# EAGLE design DDS2-03 (EAGLE 4.16)
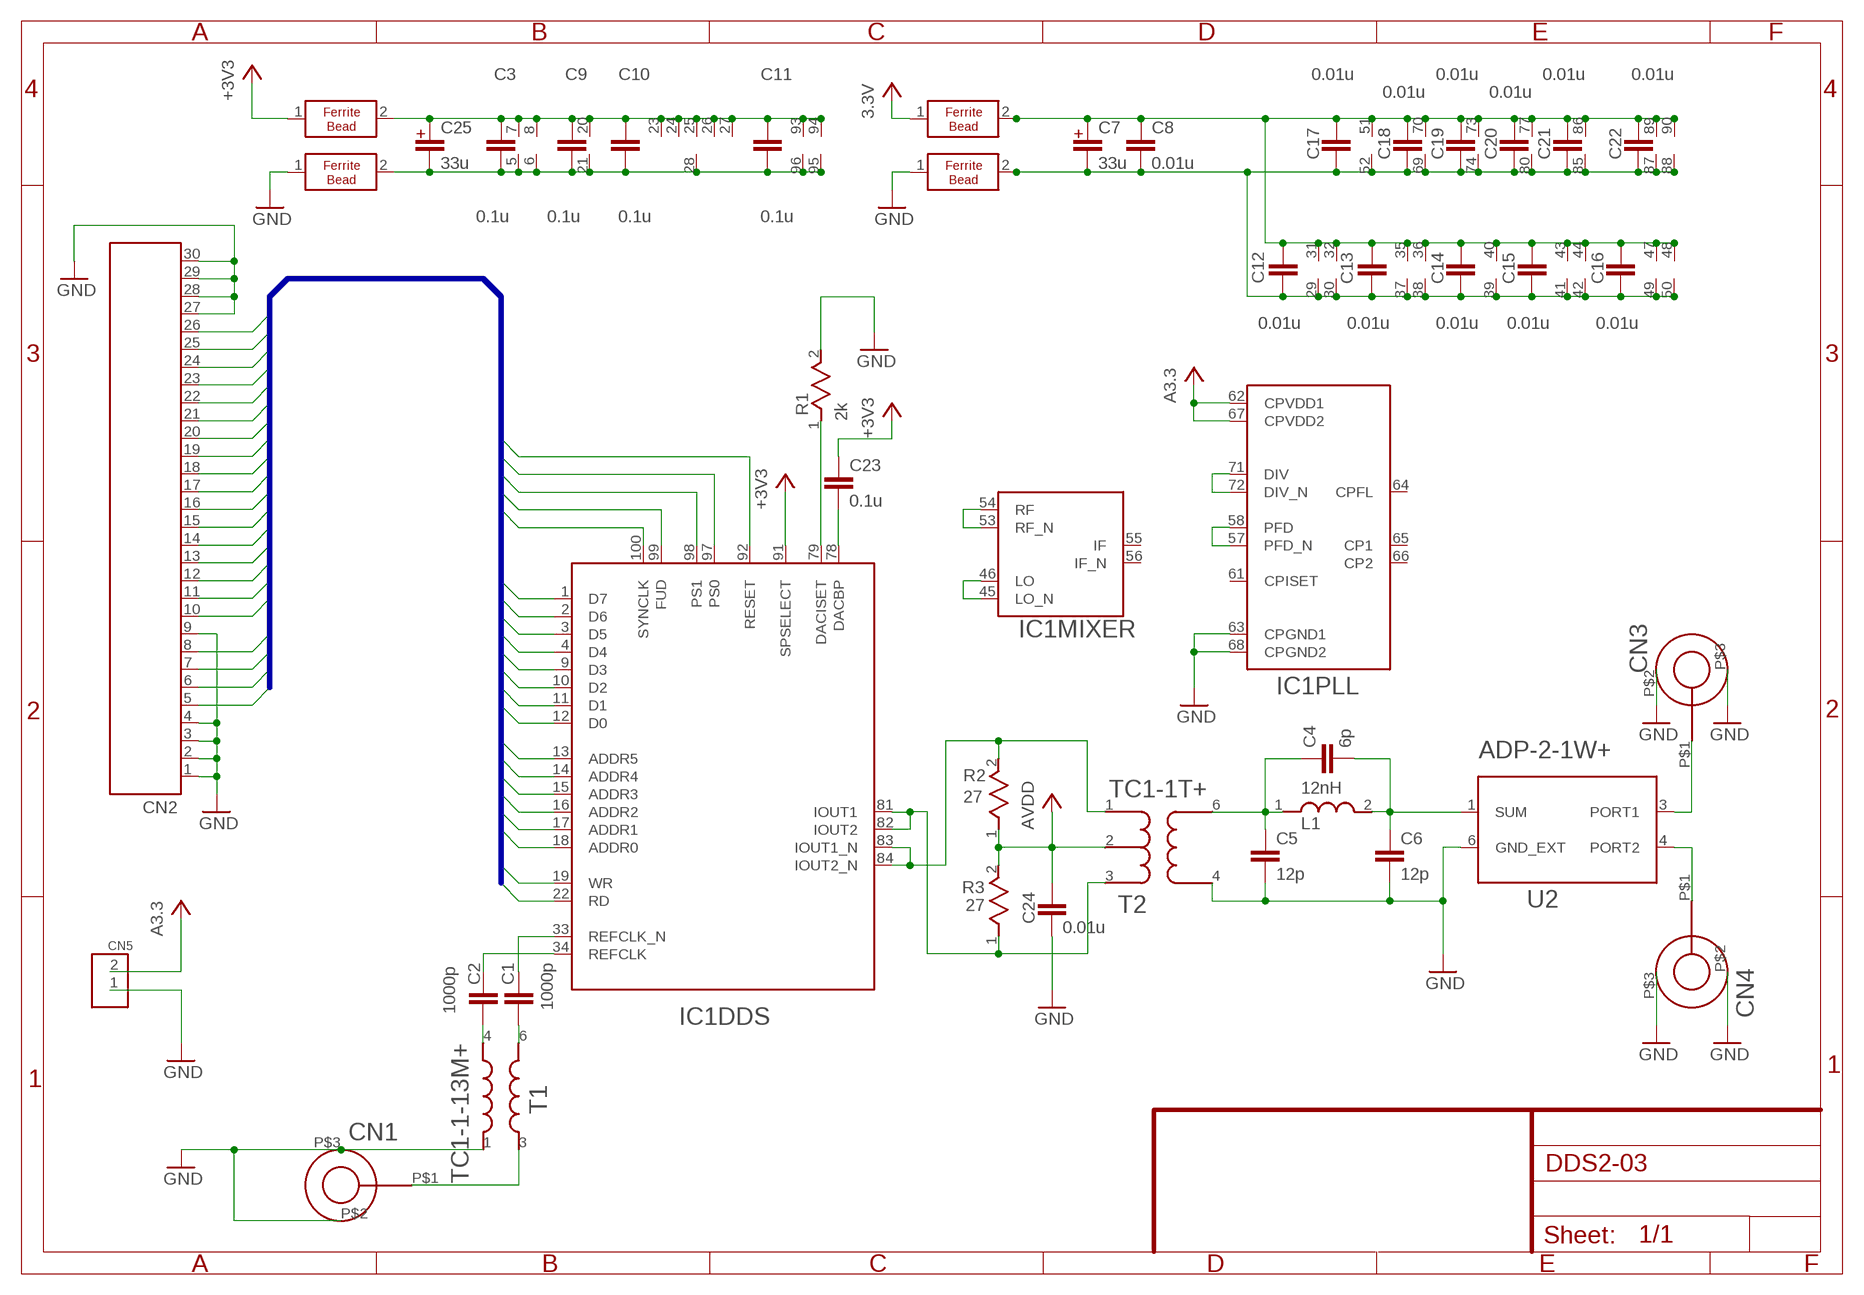
[diagram p0: schematic, sheet 1]

## Parts
C1  1000p  C1005  [1005]
C2  1000p  C1005  [1005]
C3  0.1u  C1005  [1005]
C4  6p  C1608  [1608]
C5  12p  C1608  [1608]
C6  12p  C1608  [1608]
C7  33u  C_POLAR3216  [3216_POLAR]
C8  0.01u  C1608  [1608]
C9  0.1u  C1005  [1005]
C10  0.1u  C1005  [1005]
C11  0.1u  C1005  [1005]
C12  0.01u  C1005  [1005]
C13  0.01u  C1005  [1005]
C14  0.01u  C1005  [1005]
C15  0.01u  C1005  [1005]
C16  0.01u  C1005  [1005]
C17  0.01u  C1005  [1005]
C18  0.01u  C1005  [1005]
C19  0.01u  C1005  [1005]
C20  0.01u  C1005  [1005]
C21  0.01u  C1005  [1005]
C22  0.01u  C1005  [1005]
C23  0.1u  C1005  [1005]
C24  0.01u  C1005  [1005]
C25  33u  C_POLAR3216  [3216_POLAR]
CN1  U.FL-R-SMT  [U.FL-R-SMT]
CN2  FH12-30S-0.5SH  [FPC_30]
CN3  U.FL-R-SMT  [U.FL-R-SMT]
CN4  U.FL-R-SMT  [U.FL-R-SMT]
CN5  DF13-2P-1.25V  [DF13-2P-12.5V]
FB1  FERRITEBEAD  [1608]
FB2  FERRITEBEAD  [1608]
FB3  FERRITEBEAD  [1608]
FB4  FERRITEBEAD  [1608]
IC1  AD9858SV-100  [AD9858]
L1  12nH  L  [1608]
R1  2k  R1005  [1005]
R2  27  R1005  [1005]
R3  27  R1005  [1005]
T1  TC1-1-13M+  [AT224]
T2  TC1-1T+  [AT224]
U2  ADP-2-1W  [ADP-2-1W]

## Nets
+3V3: CN5.2 FB1.1 FB3.1 ; supply symbol labelled 3.3V, A3.3
\RD: CN2.26 IC1.22(DDS:RD)
\WR: CN2.25 IC1.19(DDS:WR)
ADDR0: CN2.24 IC1.18(DDS:ADDR0)
ADDR1: CN2.23 IC1.17(DDS:ADDR1)
ADDR2: CN2.22 IC1.16(DDS:ADDR2)
ADDR3: CN2.21 IC1.15(DDS:ADDR3)
ADDR4: CN2.20 IC1.14(DDS:ADDR4)
ADDR5: CN2.19 IC1.13(DDS:ADDR5)
AGND: C5.2 C6.2 C7.2 C8.2 C12.2 C13.2 C14.2 C15.2 C16.2 C17.2 C18.2 C19.2 C20.2 C21.2 C22.2 C24.2 CN1.P$2(AGND) CN1.P$3(AGND2) CN3.P$2(AGND) CN3.P$3(AGND2) CN4.P$2(AGND) CN4.P$3(AGND2) FB4.2 IC1.29(AGND) IC1.30(AGND) IC1.37(AGND) IC1.38(AGND) IC1.39(AGND) IC1.41(AGND) IC1.42(AGND) IC1.49(AGND) IC1.50(AGND) IC1.52(AGND) IC1.63(PLL:CPGND1) IC1.68(PLL:CPGND2) IC1.69(AGND) IC1.74(AGND) IC1.80(AGND) IC1.85(AGND) IC1.87(AGND) IC1.88(AGND) R1.2 T1.1 T2.4 U2.6(GND_EXT) ; supply symbol labelled GND
AVDD: C7.1 C8.1 C12.1 C13.1 C14.1 C15.1 C16.1 C17.1 C18.1 C19.1 C20.1 C21.1 C22.1 C23.1 C24.1 FB3.2 IC1.31(AVDD) IC1.32(AVDD) IC1.35(AVDD) IC1.36(AVDD) IC1.40(AVDD) IC1.43(AVDD) IC1.44(AVDD) IC1.47(AVDD) IC1.48(AVDD) IC1.51(AVDD) IC1.62(PLL:CPVDD1) IC1.67(PLL:CPVDD2) IC1.70(AVDD) IC1.73(AVDD) IC1.77(AVDD) IC1.86(AVDD) IC1.89(AVDD) IC1.90(AVDD) IC1.91(DDS:SPSELECT) R2.1 R3.2 T2.2 ; supply symbol labelled A3.3, +3V3
D0: CN2.18 IC1.12(DDS:D0)
D1: CN2.17 IC1.11(DDS:D1)
D2: CN2.16 IC1.10(DDS:D2)
D3: CN2.15 IC1.9(DDS:D3)
D4: CN2.14 IC1.4(DDS:D4)
D5: CN2.13 IC1.3(DDS:D5)
D6: CN2.12 IC1.2(DDS:D6)
D7: CN2.11 IC1.1(DDS:D7)
DGND: C3.2 C9.2 C10.2 C11.2 C25.2 CN2.1 CN2.2 CN2.3 CN2.4 CN2.9 CN2.27 CN2.28 CN2.29 CN2.30 FB2.2 IC1.5(DGND) IC1.6(DGND) IC1.21(DGND) IC1.28(DGND) IC1.95(DGND) IC1.96(DGND) ; supply symbol labelled GND
DVDD: C3.1 C9.1 C10.1 C11.1 C25.1 FB1.2 IC1.7(DVDD) IC1.8(DVDD) IC1.20(DVDD) IC1.23(DVDD) IC1.24(DVDD) IC1.25(DVDD) IC1.26(DVDD) IC1.27(DVDD) IC1.93(DVDD) IC1.94(DVDD)
FUD: CN2.8 IC1.99(DDS:FUD)
GND: CN5.1 FB2.1 FB4.1
N$1: C1.1 T1.6
N$2: C2.1 T1.4
N$3: C1.2 IC1.33(DDS:REFCLK_N)
N$4: C2.2 IC1.34(DDS:REFCLK)
N$5: CN1.P$1 T1.3
N$6: IC1.83(DDS:IOUT1_N) IC1.84(DDS:IOUT2_N) R2.2 T2.1
N$7: IC1.53(MIXER:RF_N) IC1.54(MIXER:RF)
N$8: C23.2 IC1.78(DDS:DACBP)
N$9: IC1.81(DDS:IOUT1) IC1.82(DDS:IOUT2) R3.1 T2.3
N$10: IC1.45(MIXER:LO_N) IC1.46(MIXER:LO)
N$11: IC1.79(DDS:DACISET) R1.1
N$12: IC1.71(PLL:DIV) IC1.72(PLL:DIV_N)
N$13: IC1.57(PLL:PFD_N) IC1.58(PLL:PFD)
N$15: C4.1 C5.1 L1.1 T2.6
N$16: C4.2 C6.1 L1.2 U2.1(SUM)
N$17: CN4.P$1 U2.4(PORT2)
N$18: CN3.P$1 U2.3(PORT1)
PS0: CN2.6 IC1.97(DDS:PS0)
PS1: CN2.7 IC1.98(DDS:PS1)
RESET: CN2.5 IC1.92(DDS:RESET)
SYNCLK: CN2.10 IC1.100(DDS:SYNCLK)
Unconnected: IC1.55(MIXER:IF) IC1.56(MIXER:IF_N) IC1.59(NC) IC1.60(NC) IC1.61(PLL:CPISET) IC1.64(PLL:CPFL) IC1.65(PLL:CP1) IC1.66(PLL:CP2) IC1.75(NC) IC1.76(NC)

## Buses
BUS1:ADDR[0..5],D[0..7],\WR,\RD,FUD,RESET,PS[0..1],SYNCLK

## Notes on the sheet
- ADP-2-1W+

## Library data of the parts
C1 C2 = myCapacitor:C: CAPACITOR naming: grid - package width
C3-C6 C8-C24 = capacitor:C: CAPACITOR naming: grid - package width
C7 C25 = capacitor:C_POLAR
CN1 CN3 CN4 = HIROSE:U.FL-R-SMT
CN2 = HIROSE:FH12-30S-0.5SH
CN5 = HIROSE:DF13-2P-1.25V
FB1-FB4 = ferriteBead:FERRITEBEAD
IC1 = AnalogDevices:AD9858
L1 = inductor:L
R1-R3 = resistor:R
T1 = miniCircuits:TC1-1-13M+
T2 = miniCircuits:TC1-1T+
U2 = miniCircuits:ADP-2-1W

## Board
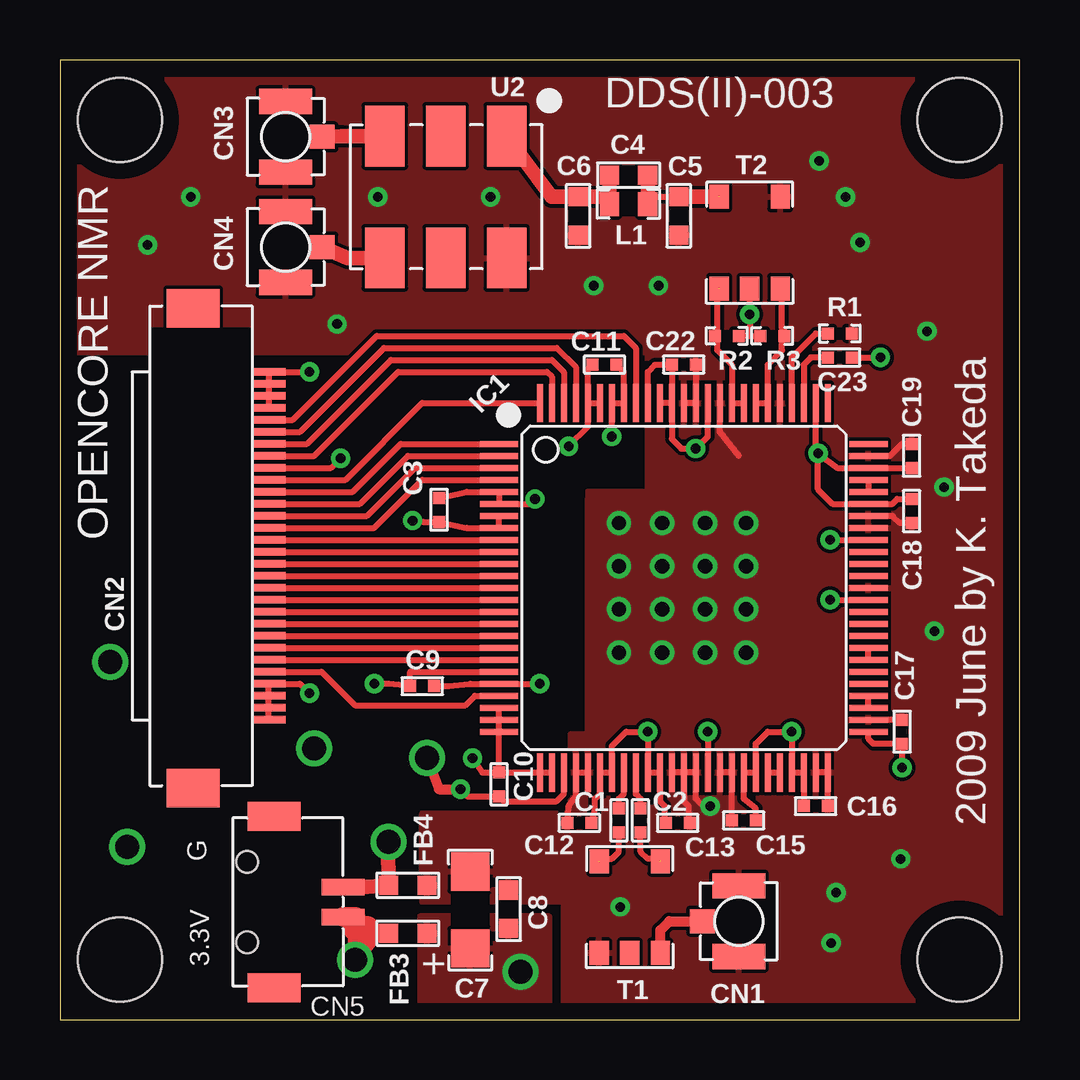
[diagram p1: board, top side]
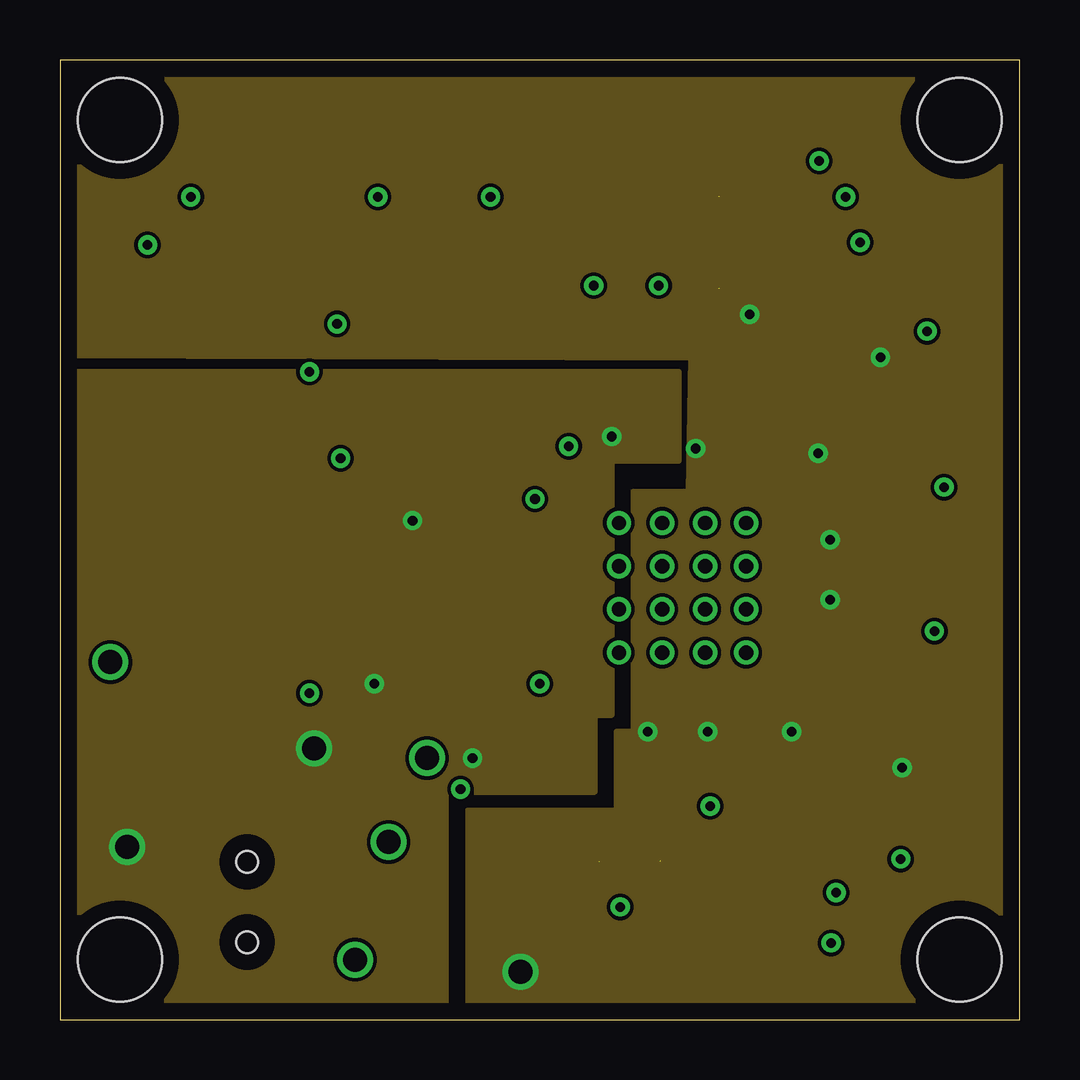
[diagram p2: board, inner layer Route2]
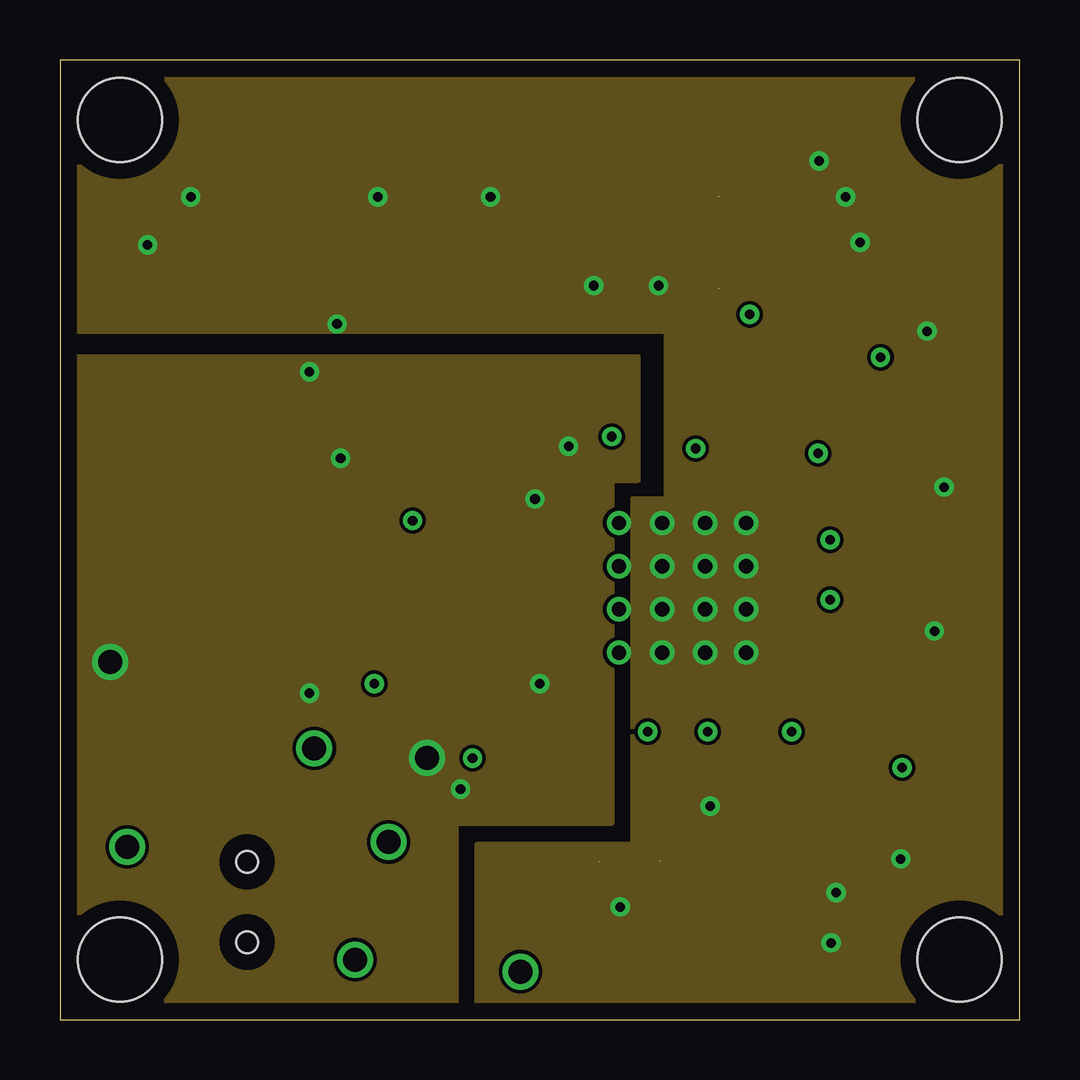
[diagram p3: board, inner layer Route3]
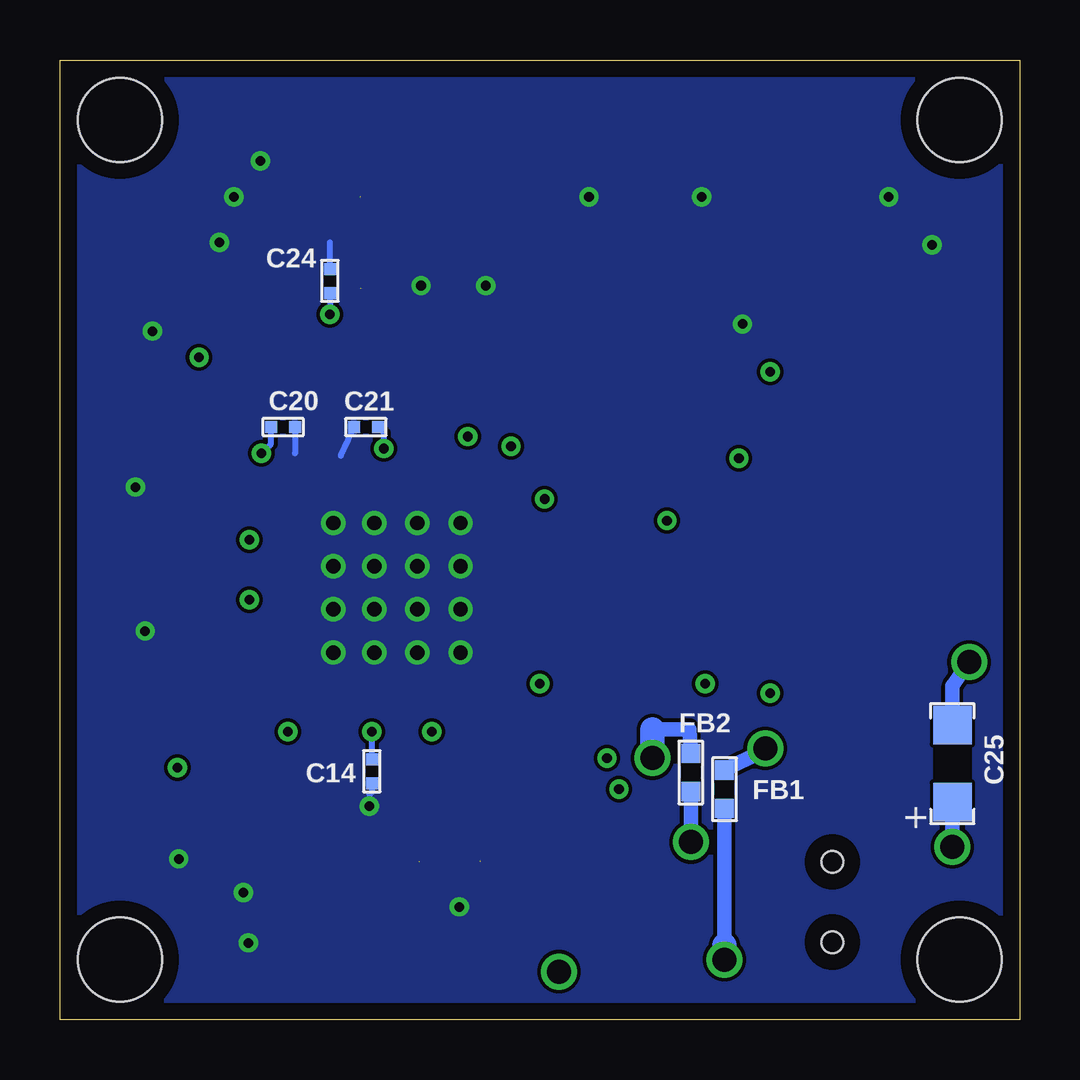
[diagram p4: board, bottom side, seen from below]

Size 40 x 40 mm. Coordinates in mm from the lower left corner, seen from the top.
Outline: 0,0 40,0 40,40 0,40 0,0
Copper layers (1*2*3*16): Top 0.035mm / dielectric 1.5mm / Route2 0.035mm / dielectric 0.15mm / Route3 0.035mm / dielectric 0.2mm / Bottom 0.035mm
Design rules "p-ban_min": minimum track width 0.15mm, minimum drill 0.3mm, track to track 0.15mm, track to pad 0.15mm, pad to pad 0.15mm, via to via 0.15mm, smd to smd 0.15mm, copper to edge 0.7mm, drill to drill 0.45mm, minimum pad ring 0.15mm, minimum via ring 0.15mm, stop-mask expansion 4mil, vias tented up to drill 0mil, thermal gap 0.15mm
Holes 3.5 mm at 2.5,2.5 37.5,2.5 37.5,37.5 2.5,37.5

### Footprints (pad centres in the part's own frame; a part is rotated, then mirrored left to right if it is on the bottom)
1005 = smd 0.5 x 0.5: 1 -0.5,0; 2 0.5,0
1608 = smd 0.8 x 0.8: 1 -0.8,0; 2 0.8,0
3216_POLAR = smd 1.6 x 1.6: 1 -1.63,0; 2 1.57,0
U.FL-R-SMT = smd 1 x 1.05: P$1 0,1.525 | smd 1.05 x 2.2: P$2 1.475,0; P$3 -1.475,0
FPC_30 = smd 0.3 x 1.4: 1 -7,2.7; 2 -6.5,2.7; 3 -6,2.7; 4 -5.5,2.7; 5 -5,2.7; 6 -4.5,2.7; 7 -4,2.7; 8 -3.5,2.7; 9 -3,2.7; 10 -2.5,2.7; 11 -2,2.7; 12 -1.5,2.7; 13 -1,2.7; 14 -0.5,2.7; 15 0,2.7; 16 0.5,2.7; 17 1,2.7; 18 1.5,2.7; 19 2,2.7; 20 2.5,2.7; 21 3,2.7; 22 3.5,2.7; 23 4,2.7; 24 4.5,2.7; 25 5,2.7; 26 5.5,2.7; 27 6,2.7; 28 6.5,2.7; 29 7,2.7; 30 7.5,2.7 | smd 1.6 x 2.2: P$21 -9.65,-0.45; P$22 10.35,-0.45
DF13-2P-12.5V = smd 0.7 x 1.8: 1 -0.625,4; 2 0.625,4 | smd 1.2 x 2.2: 3 -3.575,1.13; 4 3.575,1.13 | hole 0.9: -1.675,0; 1.675,0
AD9858 = smd 1.6 x 0.25: 1 -7.7,6; 2 -7.7,5.5; 3 -7.7,5; 4 -7.7,4.5; 5 -7.7,4; 6 -7.7,3.5; 7 -7.7,3; 8 -7.7,2.5; 9 -7.7,2; 10 -7.7,1.5; 11 -7.7,1; 12 -7.7,0.5; 13 -7.7,0; 14 -7.7,-0.5; 15 -7.7,-1; 16 -7.7,-1.5; 17 -7.7,-2; 18 -7.7,-2.5; 19 -7.7,-3; 20 -7.7,-3.5; 21 -7.7,-4; 22 -7.7,-4.5; 23 -7.7,-5; 24 -7.7,-5.5; 25 -7.7,-6; 51 7.7,-6; 52 7.7,-5.5; 53 7.7,-5; 54 7.7,-4.5; 55 7.7,-4; 56 7.7,-3.5; 57 7.7,-3; 58 7.7,-2.5; 59 7.7,-2; 60 7.7,-1.5; 61 7.7,-1; 62 7.7,-0.5; 63 7.7,0; 64 7.7,0.5; 65 7.7,1; 66 7.7,1.5; 67 7.7,2; 68 7.7,2.5; 69 7.7,3; 70 7.7,3.5; 71 7.7,4; 72 7.7,4.5; 73 7.7,5; 74 7.7,5.5; 75 7.7,6 | smd 0.25 x 1.6: 26 -6,-7.7; 27 -5.5,-7.7; 28 -5,-7.7; 29 -4.5,-7.7; 30 -4,-7.7; 31 -3.5,-7.7; 32 -3,-7.7; 33 -2.5,-7.7; 34 -2,-7.7; 35 -1.5,-7.7; 36 -1,-7.7; 37 -0.5,-7.7; 38 0,-7.7; 39 0.5,-7.7; 40 1,-7.7; 41 1.5,-7.7; 42 2,-7.7; 43 2.5,-7.7; 44 3,-7.7; 45 3.5,-7.7; 46 4,-7.7; 47 4.5,-7.7; 48 5,-7.7; 49 5.5,-7.7; 50 6,-7.7; 76 6,7.7; 77 5.5,7.7; 78 5,7.7; 79 4.5,7.7; 80 4,7.7; 81 3.5,7.7; 82 3,7.7; 83 2.5,7.7; 84 2,7.7; 85 1.5,7.7; 86 1,7.7; 87 0.5,7.7; 88 0,7.7; 89 -0.5,7.7; 90 -1,7.7; 91 -1.5,7.7; 92 -2,7.7; 93 -2.5,7.7; 94 -3,7.7; 95 -3.5,7.7; 96 -4,7.7; 97 -4.5,7.7; 98 -5,7.7; 99 -5.5,7.7; 100 -6,7.7
1608' = smd 0.8 x 1: 1 -0.8,0; 2 0.8,0
AT224 = smd 1 x 0.8: 1 -1.925,1.275; 2 -1.925,0; 3 -1.925,-1.275; 4 1.9,-1.275; 6 1.9,1.275
ADP-2-1W = smd 1.65 x 2.54: 1 -2.52,-2.53; 2 0.02,-2.53; 3 2.56,-2.53; 4 2.56,2.55; 5 0.02,2.55; 6 -2.52,2.55

### Placement (x,y rotation side)
C1  23.3,8.3 90 top
C2  24.2,8.3 90 top
C3  15.8,21.25 90 top
C4  23.7,35.2 180 top
C5  25.8,33.5 270 top
C6  21.6,33.5 270 top
C7  17.1,4.6 90 top
C8  18.7,4.6 90 top
C9  15.1,13.9 0 top
C10  18.3,9.8 270 top
C11  22.7,27.3 180 top
C12  21.65,8.2 180 top
C13  25.75,8.2 0 top
C14  27,10.35 270 bottom
C15  28.5,8.3 180 top
C16  31.5,8.9 0 top
C17  35.1,12 90 top
C18  35.5,21.2 270 top
C19  35.5,23.5 90 top
C20  30.7,24.7 0 bottom
C21  27.25,24.7 180 bottom
C22  26,27.3 0 top
C23  32.5,27.6 180 top
C24  28.75,30.79 90 bottom
C25  2.8,10.7 90 bottom
CN1  28.3,4.1 90 top
CN2  6,20 270 top
CN3  9.4,36.8 270 top
CN4  9.4,32.2 270 top
CN5  7.8,4.9 270 top
FB1  12.3,9.6 90 bottom
FB2  13.7,10.3 90 bottom
FB3  14.5,3.6 0 top
FB4  14.5,5.6 0 top
IC1  26,18 0 top
L1  12nH  [1608']  23.7,34 180 top
R1  32.5,28.6 0 top
R2  27.8,28.5 180 top
R3  29.7,28.5 180 top
T1  23.75,4.7 90 top
T2  28.75,32.4 90 top
U2  16.1,34.3 180 top

### Tracks (layer width: path | path; a pad name or v marks a point on that pad's centre or on a via)
+3V3  (via drill 1)
  Top 0.61: 13.1,3.5 12.32,4.28 | 13.1,3.5 FB3.1 | 12.3,3.8 v12.3,2.5 13.1,3.5
  Top 0.813: 12.32,4.28 CN5.2
  Top 1.016: 12.3,3.8 12.8,3.8
  Bottom 0.61: 12.3,3.1 FB1.1
  Bottom 1.016: v12.3,2.5 12.3,3.1
\RD
  Top 0.254: IC1.22 17.3,13.5 16.9,13.1 12.3,13.1 10.9,14.5 CN2.26
\WR
  Top 0.254: CN2.25 IC1.19
ADDR0
  Top 0.254: CN2.24 IC1.18
ADDR1
  Top 0.254: CN2.23 IC1.17
ADDR2
  Top 0.254: CN2.22 IC1.16
ADDR3
  Top 0.254: CN2.21 IC1.15
ADDR4
  Top 0.254: CN2.20 IC1.14
ADDR5
  Top 0.254: CN2.19 IC1.13
AGND  (via drill 0.4 pad 0.8, 0.6 pad 1.02)
  Top 0.254: IC1.88 IC1.87 C22.2 | C17.2 IC1.52 | C19.2 35.1,24 34.6,23.5 IC1.74 | C18.2 35,20.7 34.7,21 IC1.69 | IC1.85 27.5,24.5 28.3,23.5 | IC1.30 IC1.29 21.5,9.3 21.2,8.9 21.2,8.85 C12.2 | IC1.49 IC1.50 C16.2 | IC1.41 IC1.42 C15.2 | IC1.38 IC1.37 | IC1.38 IC1.39 26.5,9.2 26.7,9 27,9 v27.1,8.9 | IC1.38 26,9.1 26.2,8.9 26.2,8.24 C13.2
  Bottom 0.254: C20.2 30.2,23.6 | 28.3,23.5 28,24.15 C21.2 | C14.2 27,9.5 27.1,9.4 v27.1,8.9 | C24.2 28.75,32.4
  other vias: 25.1,18.9 25.1,20.7 25.1,15.3 25.1,17.1 23.3,18.9 23.3,20.7 23.3,15.3 23.3,17.1 26.9,18.9 26.9,20.7 26.9,15.3 26.9,17.1 28.6,18.9 28.6,20.7 28.6,15.3 28.6,17.1 33.35,32.4 5.45,34.3 3.65,32.3 22.25,30.59 24.95,30.59 32.35,5.29 32.15,3.19 36.45,16.2 13.25,34.3 11.55,29 32.75,34.3 31.65,35.8 36.15,28.7 36.85,22.2 35.05,6.7 23.35,4.7 17.95,34.3
  pour Top (isolate 0.254): 22,14 30,14 30,22 22,22
  pour Top: 40,0 21,0 21,4.9 15.1,4.9 15.1,8.6 21.3,8.6 21.3,11.9 22,11.9 22,21.7 24.5,21.7 24.5,27.8 0,27.8 0,40 40,40
  pour Route3: 0,40 40,40 40,0 17.4,0 17.4,7.3 23.9,7.3 23.9,21.7 25.3,21.7 25.3,28.7 0,28.7
  pour Bottom: 0,0 40,0 40,40 0,40
AVDD  (via drill 0.4 pad 0.8, 1)
  Top 0.254: v27,12 IC1.40 | C15.1 29,8.8 28.5,9.2 IC1.43 IC1.44 29,11.5 29.5,12 v30.5,12 IC1.47 IC1.48 C16.1 | C12.1 22.3,8.75 22.3,9.2 22.5,9.4 IC1.31 IC1.32 23,11.4 23.6,12 v24.5,12 IC1.35 IC1.36 25,9.1 25.2,8.9 25.2,8.25 C13.1 | IC1.89 IC1.90 | IC1.51 33.7,11.7 33.9,11.5 C17.1 v35.1,10.5 | v31.6,23.6 32.4,23 IC1.73 C19.1 | v31.6,23.6 31.6,22.1 32.2,21.5 IC1.70 34.7,21.5 34.9,21.7 C18.1 | IC1.89 C22.1 24.8,27.3 24.5,27 IC1.91 | IC1.86 27,24.3 v26.5,23.8 25.9,23.8 25.5,24.2 IC1.89 | IC1.77 31.5,23.7 v31.6,23.6 | v32.1,20 IC1.67 | v32.1,17.5 IC1.62 | 28.75,28.5 R2.1 | 28.75,28.5 R3.2 | T2.2 v28.75,29.4 28.75,28.5 | C23.1 v34.2,27.6
  Bottom 0.254: C14.1 v27,12 | v26.5,23.8 26.5,24.45 C21.1 | C20.1 31.2,24 v31.6,23.6 | C24.1 v28.75,29.4
  other vias: 19.2,2
  pour Top: 15,0 20.4,0 20.4,4.3 15,4.3
  pour Route2: 17,0 40,0 40,40 0,40 0,27.7 26.3,27.6 26.2,22 23.9,22 23.9,12 23.2,12 23.2,8.7 17,8.7
D0
  Top 0.254: CN2.18 IC1.12
D1
  Top 0.254: CN2.17 IC1.11
D2
  Top 0.254: CN2.16 IC1.10
D3
  Top 0.254: CN2.15 IC1.9
D4
  Top 0.254: IC1.4 15.1,22.5 13.1,20.5 CN2.14
D5
  Top 0.254: CN2.13 12.8,21 14.8,23 IC1.3
D6
  Top 0.254: IC1.2 14.5,23.5 12.5,21.5 CN2.12
D7
  Top 0.254: CN2.11 12.2,22 14.2,24 IC1.1
DGND  (via drill 0.4 pad 0.8, 1)
  Top 0.254: C3.2 16.95,22 IC1.5 IC1.6 19.6,21.5 v19.8,21.7 | C9.2 16.2,13.9 17.1,14 IC1.21 v20,14 | IC1.28 21,9.4 20.7,9.1 18.5,9.1 C10.2 17,9.3 v16.7,9.6 | IC1.96 IC1.95 | IC1.96 22,27.1 C11.2 | IC1.96 22,24.7 v21.2,23.9 | CN2.30 CN2.29 CN2.28 CN2.27 10,14 v10.4,13.6 | CN2.4 CN2.3 CN2.2 CN2.1 v10.4,27 | CN2.9 11.3,23 v11.7,23.4
  Top 0.406: v16.7,9.6 15.8,9.6 v15.3,10.9
  Bottom 0.61: 15.3,12.1 13.77,12.1 FB2.2 | C25.2 2.8,13.9 v2.1,14.9
  Bottom 1.016: 15.3,12.1 v15.3,10.9
  pour Route3: 0,0 16.5,0 16.5,8.2 23,8.2 23,22.5 24.1,22.5 24.1,27.6 0,27.6
DVDD  (via drill 0.4 pad 0.8, 1)
  Top 0.254: IC1.7 IC1.8 16.95,20.5 C3.1 15.15,20.75 v14.7,20.8 | IC1.20 14.6,14.5 C9.1 13.7,14 v13.1,14 | IC1.23 IC1.24 IC1.25 C10.1 | IC1.27 IC1.26 C10.1 | C11.1 23.5,27 IC1.93 IC1.94 v23,24.3 | C10.1 17.6,10.3 v17.2,10.9
  Bottom 0.61: FB1.2 10.73,11.17 | v2.8,7.2 C25.1
  Bottom 1.016: 10.73,11.17 v10.6,11.3
  pour Route2: 0,0 16.1,0 16.1,9.5 22.3,9.5 22.3,12.7 23,12.7 23,23.3 25.8,23.3 25.8,27 0,27
FUD
  Top 0.254: IC1.99 20.5,26.8 20.3,27 14.1,27 10.6,23.5 CN2.8
GND  (via drill 1)
  Top 0.61: CN5.1 12.79,5.53 FB4.1 13.67,7.27
  Top 1.016: 13.67,7.27 v13.7,7.4
  Bottom 0.61: v13.7,7.4 FB2.1
N$1  (1 unrouted)
  Top 0.254: C1.1 23.3,7 23,6.7 22.58,6.7 T1.6
N$2  (1 unrouted)
  Top 0.254: C2.1 24.2,7 24.5,6.7 24.92,6.7 T1.4
N$3
  Top 0.254: IC1.33 23.5,9.4 23.3,9.2 C1.2
N$4
  Top 0.254: C2.2 24.2,9.2 24,9.4 IC1.34
N$5
  Top 0.406: T1.3 25.02,3.73 25.4,4.1 CN1.P$1
N$6  (1 unrouted)
  Top 0.254: IC1.83 IC1.84 28,27.3 27.4,27.9 27.4,28.2 R2.2 27.3,28.7 27.4,28.8 27.4,30.41 T2.1
N$7
  Top 0.254: IC1.53 IC1.54
N$8
  Top 0.254: IC1.78 31,27.3 31.3,27.6 C23.2
N$9
  Top 0.254: IC1.82 IC1.81 29.5,27.3 30.1,27.9 30.1,28.2 R3.1 30.2,28.7 30.1,28.8 30.1,30.4 T2.3
N$10
  Top 0.254: IC1.45 IC1.46
N$11
  Top 0.254: IC1.79 30.5,27.6 31.5,28.6 R1.1
N$12
  Top 0.254: IC1.72 IC1.71
N$13
  Top 0.254: IC1.57 IC1.58
N$15  (1 unrouted)
  Top 0.254: C5.1 24.8,34.3 L1.1
  Top 0.61: C4.1 L1.1 | C5.1 T2.6
N$16
  Top 0.254: 22.6,34.3 L1.2
  Top 0.61: L1.2 C4.2 | 22.6,34.3 C6.1 20.49,34.3 U2.1
N$17
  Top 0.61: U2.4 11.98,31.75 CN4.P$1
N$18
  Top 0.61: U2.3 12.13,36.83 11.73,36.83 CN3.P$1
PS0
  Top 0.254: IC1.97 21.5,27.2 20.7,28 13.5,28 10,24.5 CN2.6
PS1
  Top 0.254: CN2.7 10.3,24 13.8,27.5 20.5,27.5 21,27 IC1.98
RESET
  Top 0.254: CN2.5 9.7,25 13.2,28.5 23.5,28.5 24,28 IC1.92
SYNCLK
  Top 0.254: IC1.100 15.1,25.7 11.9,22.5 CN2.10

### Text on the board
tNames: DDS(II)-003 | OPENCORE NMR | 2009 June by K. Takeda | G | 3.3V